# EAGLE design ins_node (EAGLE 8.4.3)
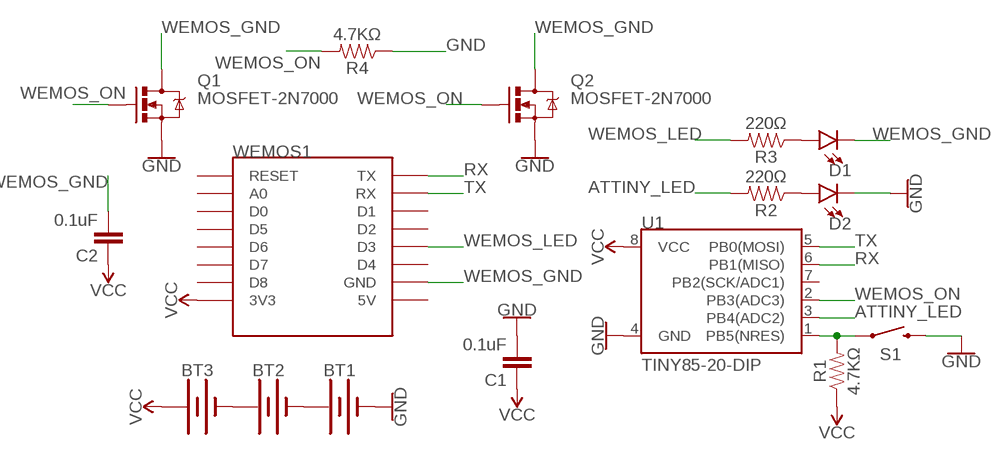
[diagram p0: schematic, sheet 1]

## Parts
BT1  BATTERY-AAA  [BATTERY-AAA]
BT2  BATTERY-AAA  [BATTERY-AAA]
BT3  BATTERY-AAA  [BATTERY-AAA]
C1  0.1uF  0.1UF-KIT-EZ-50V-20%  [CAP-PTH-SMALL-KIT]
C2  0.1uF  0.1UF-KIT-EZ-50V-20%  [CAP-PTH-SMALL-KIT]
D1  LED5MM-KIT  [LED_5MM-KIT]
D2  LED5MM-KIT  [LED_5MM-KIT]
Q1  MOSFET-2N7000  MOSFET-NCHANNEL2N7000  [TO-92]
Q2  MOSFET-2N7000  MOSFET-NCHANNEL2N7000  [TO-92]
R1  4.7KΩ  RESISTORAXIAL-0.3  [AXIAL-0.3]
R2  220Ω  RESISTORAXIAL-0.3  [AXIAL-0.3]
R3  220Ω  RESISTORAXIAL-0.3  [AXIAL-0.3]
R4  4.7KΩ  RESISTORAXIAL-0.3  [AXIAL-0.3]
S1  MOMENTARY-SWITCH-SPST-PTH-6.0MM  [TACTILE_SWITCH_PTH_6.0MM]
U1  TINY85-20-DIP  ATTINY45TINY85-20-DIP  [DIP08_MCU]
WEMOS1  WEMOS-D1-MINI  [WEMOS-D1-MINI]

## Nets
ATTINY_LED: R2.P$2 U1.3(PB4(ADC2))
GND: BT1.GND@1(-) C1.2 D2.K(C) Q1.1(S) Q2.1(S) R4.P$1 S1.3 U1.4(GND)
N$1: BT1.PWR@1(+) BT2.GND@1(-)
N$2: R1.P$2 S1.1 U1.1(PB5(NRES))
N$3: D1.A R3.P$1
N$4: D2.A R2.P$1
N$5: BT2.PWR@1(+) BT3.GND@1(-)
RX: U1.6(PB1(MISO)) WEMOS1.TX
TX: U1.5(PB0(MOSI)) WEMOS1.RX
VCC: BT3.PWR@1(+) C1.1 C2.1 R1.P$1 U1.8(VCC) WEMOS1.3V3
WEMOS_GND: C2.2 D1.K(C) Q1.3(D) Q2.3(D) WEMOS1.GND
WEMOS_LED: R3.P$2 WEMOS1.D3
WEMOS_ON: Q1.2(G) Q2.2(G) R4.P$2 U1.2(PB3(ADC3))
Unconnected: U1.7(PB2(SCK/ADC1)) WEMOS1.5V WEMOS1.A0 WEMOS1.D0 WEMOS1.D1 WEMOS1.D2 WEMOS1.D4 WEMOS1.D5 WEMOS1.D6 WEMOS1.D7 WEMOS1.D8 WEMOS1.RESET

## Library data of the parts
BT1-BT3 = SparkFun-Batteries:BATTERY: Battery - Single Cell A variety of battery chemistries, sizes, and footprints. Device List: 20MM_PTH - Coin Cell Battery Holder - 20mm (PTH) <https://www.sparkfun.com/products/783> 6.8MM_PTH - Coin Cell Battery Holder - 6.8MM(SMD) <https://www.digikey.com/product-detail/en/seiko-instruments/MS621FE-FL11E/728-1057-ND/1889208?WT.srch=1&gclid=CNOQ5a6LzdQCFZS2wAodXCkE0g> 12MM_SMD - Coin Cell Battery Holder - 12mm (SMD) <https://www.sparkfun.com/products/10592> 12MM_PTH - Coin Cell Battery Holder - 12mm (PTH) <https://www.sparkfun.com/products/7948> 20MM_SMD - 20mm Coin Cell Battery Holder (SMD) (2 legs) Used on the Big Time Watch Kit <https://www.sparkfun.com/products/11734> 20MM_SMD_4LEGS - Coin Cell Battery Holder - 20mm (SMD) <https://www.sparkfun.com/products/11892> 20MM_SMD_4LEGS_OVERPASTE - Coin Cell Battery Holder - 20mm (SMD) <https://www.sparkfun.com/products/11892> (Over-paste on the legs) 24.5MM_PTH - Coin Cell Battery Holder - 24.5mm (PTH) <https://www.sparkfun.com/products/8863> 9V - 9V Battery Holder - PC Mount Used on the SparkFun SparkPunk Sound Kit <https://www.sparkfun.com/products/11177> and SparkFun SparkPunk Sequencer Kit <https://www.sparkfun.com/products/12707> 18650 - Battery Holder - 18650 (PTH) <https://www.sparkfun.com/products/13113> AA - Battery Holder - 1xAA (PTH) <https://www.sparkfun.com/products/7949> AAA - Battery Holder - 1xAAA (PTH) <https://www.sparkfun.com/products/12718> AA_KIT - Battery Holder - 1xAA (PTH) <https://www.sparkfun.com/products/7949> Special kit package - pads only have exposed copper on one side of the board. AAA_KIT - Battery Holder - 1xAAA (PTH) <https://www.sparkfun.com/products/12718> Special kit package - pads only have exposed copper on one side of the board.; PROD_ID: BATT-08571; SF_SKU: PRT-12718
C1 C2 = SparkFun-Capacitors:0.1UF: 0.1µF ceramic capacitors A capacitor is a passive two-terminal electrical component used to store electrical energy temporarily in an electric field.; PROD_ID: CAP-08370
D1 D2 = SparkFun-LED:LED: LED (Generic) Standard schematic elements and footprints for 5mm, 3mm, 1206, and 0603 sized LEDs. Generic LEDs with no color specified.
Q1 Q2 = SparkFun-DiscreteSemi:MOSFET-NCHANNEL: Common NMOSFET Parts MFG P/N Store ID Prod ID FDD8780 TRANS-09984 SI7820DN TRANS-11055 FDS6630A IC-08089 2N7002PW TRANS-11151 FQP30N06L COM-10213 TRANS-10060 BSS123LT1G TRANS-08345 BSS138 TRANS-00830 BS170 2N7000
R1-R4 = SparkFun-Resistors:RESISTOR: Generic Resistor Package
S1 = SparkFun-Switches:MOMENTARY-SWITCH-SPST: Momentary Switch (Pushbutton) - SPST Normally-open (NO) SPST momentary switches (buttons, pushbuttons). Variants PTH-12MM - 12mm square, through-hole Momentary Pushbutton Switch - 12mm Square <https://www.sparkfun.com/products/9190> (COM-09190) PTH-6.0MM, PTH-6.0MM-KIT - 6.0mm square, through-hole Mini Pushbutton Switch <https://www.sparkfun.com/products/97> (COM-00097) KIT package intended for soldering kit's - only one side of pads' copper is exposed. PTH-RIGHT-ANGLE-KIT - Right-angle, through-hole Right Angle Tactile Button <https://www.sparkfun.com/products/10791> - Used on SparkFun BigTime Watch Kit <https://www.sparkfun.com/products/11734> SMD-12MM - 12mm square, surface-mount Tactile Button - SMD (12mm) <https://www.sparkfun.com/products/12993> (COM-12993) Used on SparkFun PicoBoard <https://www.sparkfun.com/products/11888> SMD-4.5MM - 4.5mm Square Trackball Switch Used on SparkFun Blackberry Trackballer Breakout <https://www.sparkfun.com/products/13169> SMD-4.6MMX2.8MM - 4.60mm x 2.80mm, surface mount Used on SparkFun SAMD21 Mini Breakout <https://www.sparkfun.com/products/13664> SMD-5.2MM, SMD-5.2-REDUNDANT - 5.2mm square, surface-mount Mini Pushbutton Switch - SMD <https://www.sparkfun.com/products/8720> (COM-08720) Used on Arduino Pro Mini <https://www.sparkfun.com/products/11114> REDUNDANT package connects both switch circuits together SMD-6.0X3.5MM - 6.0 x 3.5mm, surface mount Momentary Reset Switch SMD <https://www.sparkfun.com/products/8229> (COM-08229) SMD-6.2MM-TALL - 6.2mm square, surface mount Tactile Button - SMD (6mm) <https://www.sparkfun.com/products/12992> Used on SparkFun Digital Sandbox <https://www.sparkfun.com/products/12651> SMD-RIGHT-ANGLE - Right-angle, surface mount Used on SparkFun Block for Intel® Edison - Arduino <https://www.sparkfun.com/products/13036>; PROD_ID: SWCH-08441; SF_SKU: COM-00097
U1 = SparkFun-Retired:ATTINY45: Atmel 8-pin 2/4/8kB flash uC Retired; PROD_ID: IC-09445
WEMOS1 = esp8266modules:WEMOS-D1-MINI: WeMos.cc D1 mini ESP8266 module

## Board
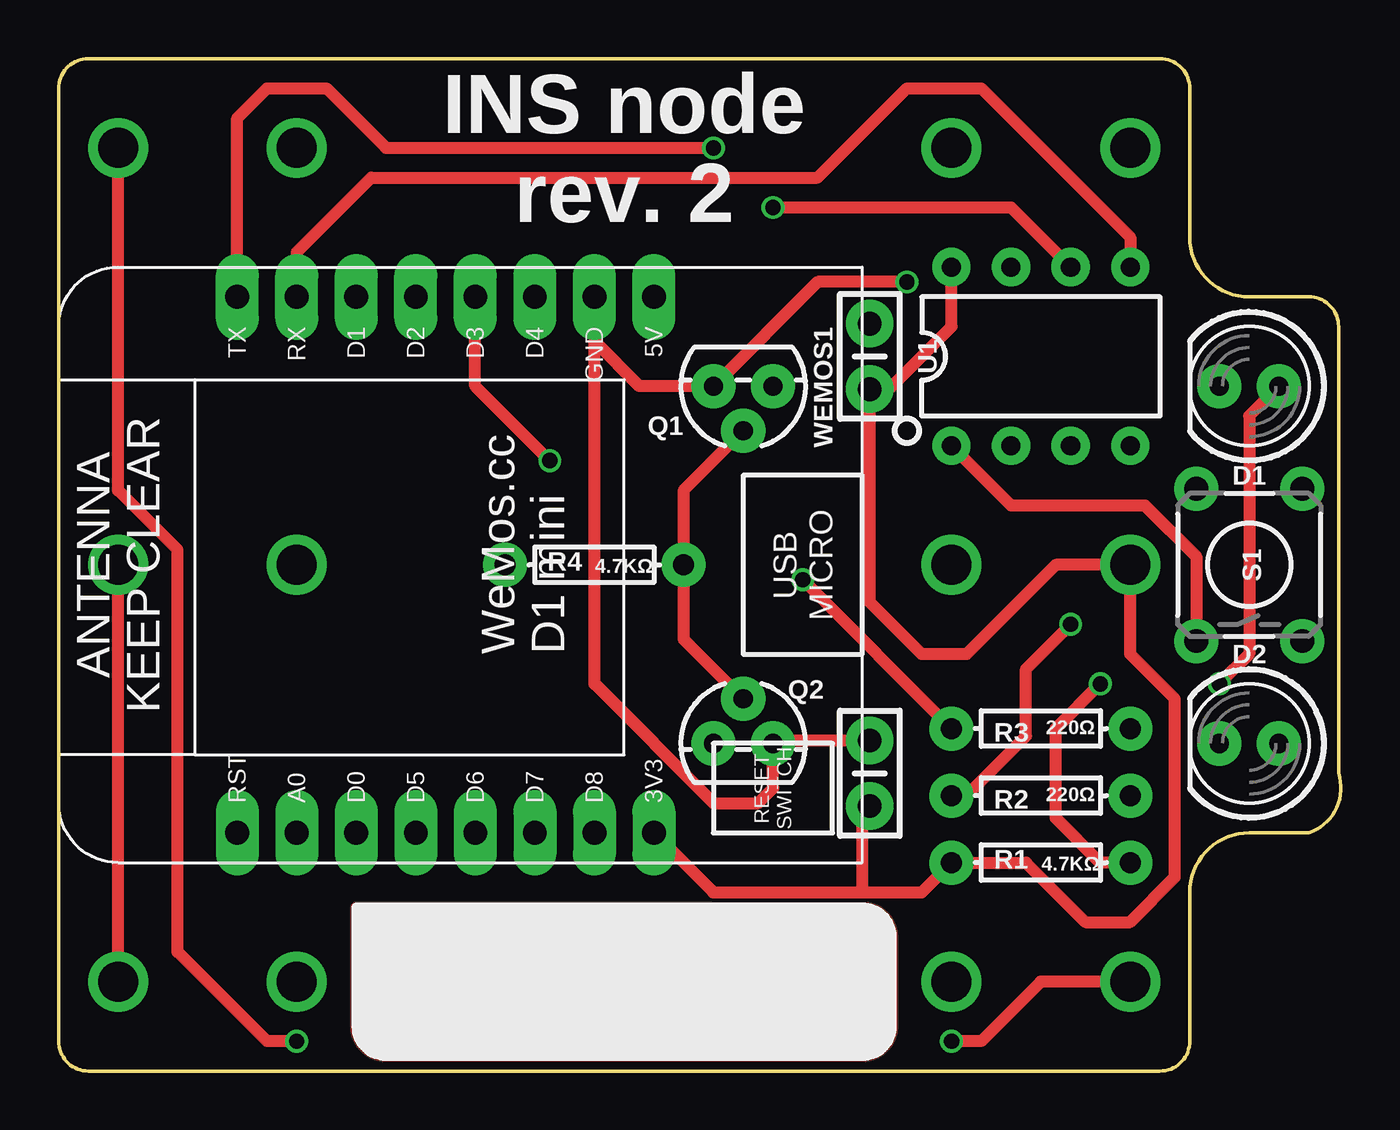
[diagram p1: board, top side]
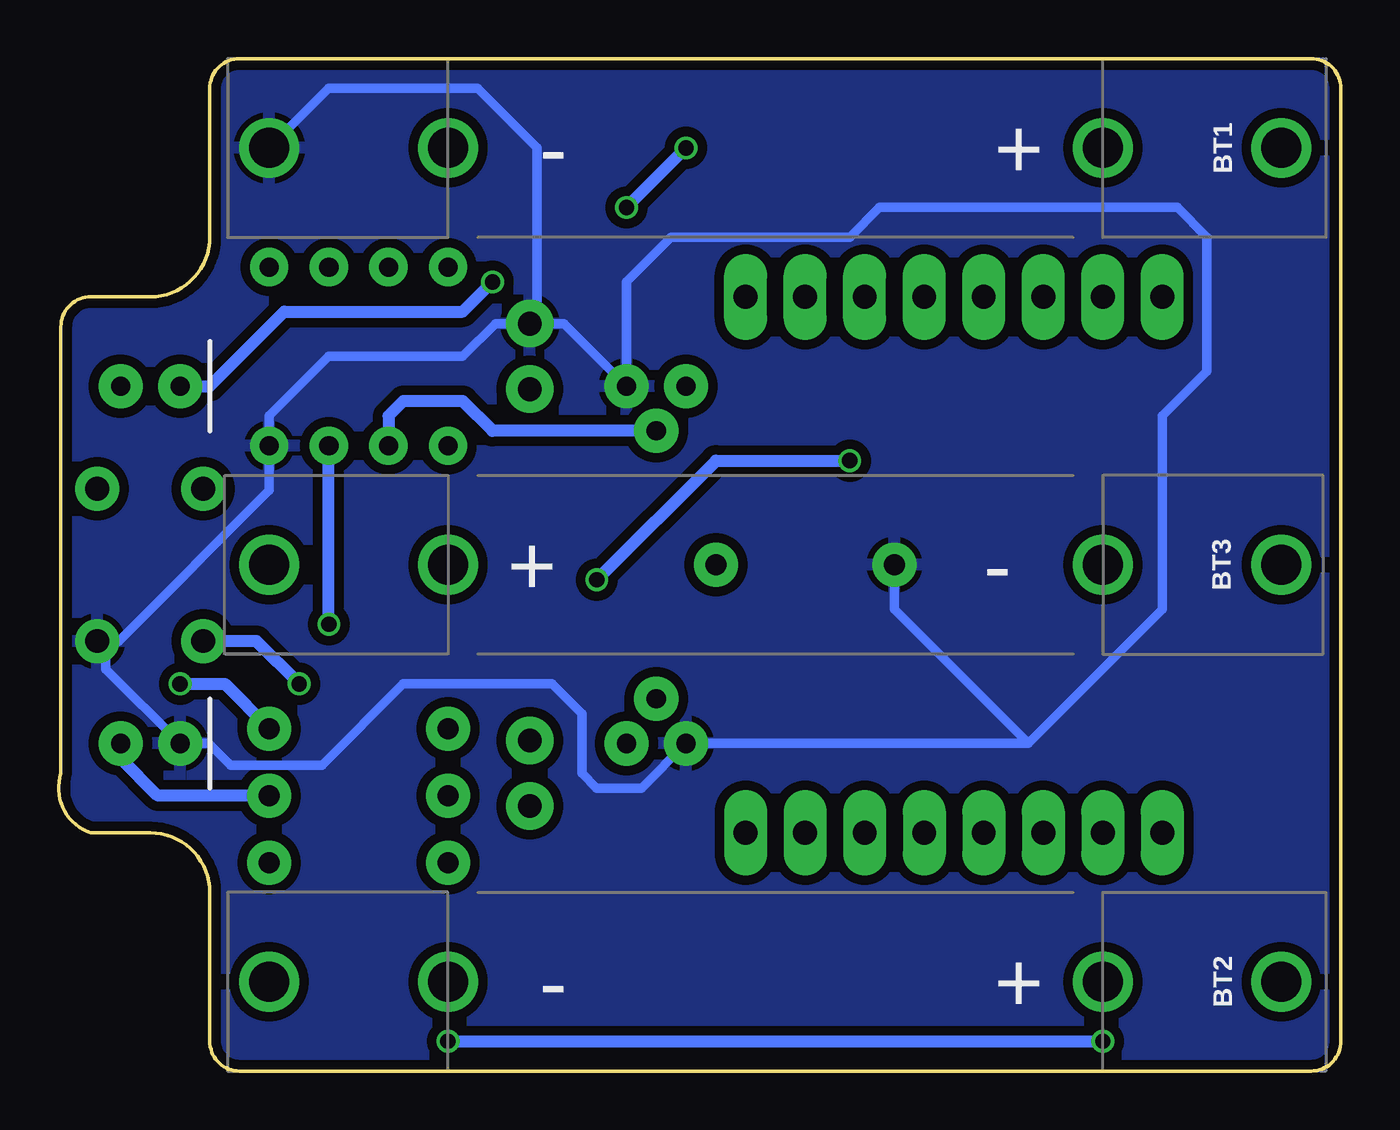
[diagram p2: board, bottom side, seen from below]

Size 54.71 x 43.18 mm. Coordinates in mm from the lower left corner, seen from the top.
Outline: 1.27,43.18 arc90 0,41.91 0,1.27 arc90 1.27,0 46.99,0 arc90 48.26,1.27 48.26,7.62 arc-90 50.8,10.16 53.34,10.16 arc90 54.61,12.7 54.61,31.75 arc90 53.34,33.02 50.8,33.02 arc-90 48.26,35.56 48.26,41.91 arc90 46.99,43.18 1.27,43.18
Copper layers (1*16): Top 0.035mm / dielectric 1.5mm / Bottom 0.035mm
Design rules "SeeedStudio_2layer_DRU_edited": minimum track width 7mil, minimum drill 15mil, track to track 6mil, track to pad 6mil, pad to pad 6mil, via to via 6mil, smd to smd 0mil, copper to edge 10mil, drill to drill 10mil, minimum pad ring 10mil, minimum via ring 6mil, stop-mask expansion 2mil, vias tented up to drill 100mil, thermal gap 10mil

### Footprints (pad centres in the part's own frame; a part is rotated, then mirrored left to right if it is on the bottom)
BATTERY-AAA = drill 1.702: GND@1 21.59,0; GND@2 13.97,0; PWR@1 -21.59,0; PWR@2 -13.97,0
CAP-PTH-SMALL-KIT = drill 1.016 pad 2.032: 1 -1.397,0; 2 1.397,0
LED_5MM-KIT = drill 0.813 pad 1.88: A -1.27,0; K 1.27,0
TO-92 = drill 0.813 pad 1.88: 1 -1.27,0; 2 0,1.905; 3 1.27,0
AXIAL-0.3 = drill 0.9 pad 1.88: P$1 -3.81,0; P$2 3.81,0
TACTILE_SWITCH_PTH_6.0MM = drill 1.016 pad 1.88: 1 -3.251,2.261; 2 3.251,2.261; 3 -3.251,-2.261; 4 3.251,-2.261
DIP08_MCU = drill 0.813 pad 1.626: 1 -3.81,-3.81; 2 -1.27,-3.81; 3 1.27,-3.81; 4 3.81,-3.81; 5 3.81,3.81; 6 1.27,3.81; 7 -1.27,3.81; 8 -3.81,3.81
WEMOS-D1-MINI = drill 1.016 pad 1.829 long: 3V3 -10.16,-10.16; 5V 12.7,-10.16; A0 -10.16,5.08; D0 -10.16,2.54; D1 12.7,2.54; D2 12.7,0; D3 12.7,-2.54; D4 12.7,-5.08; D5 -10.16,0; D6 -10.16,-2.54; D7 -10.16,-5.08; D8 -10.16,-7.62; GND 12.7,-7.62; RESET -10.16,7.62; RX 12.7,5.08; TX 12.7,7.62

### Placement (x,y rotation side)
BT1  24.13,39.37 180 bottom
BT2  24.13,3.81 180 bottom
BT3  24.13,21.59 0 bottom
C1  34.61,30.48 90 top
C2  34.61,12.7 90 top
D1  50.8,29.21 180 top
D2  50.8,13.97 180 top
Q1  29.21,29.21 180 top
Q2  29.21,13.97 0 top
R1  41.91,8.89 0 top
R2  41.91,11.75 180 top
R3  41.91,14.61 180 top
R4  22.86,21.59 0 top
S1  50.8,21.59 90 top
U1  41.91,30.48 0 top
WEMOS1  15.24,20.32 90 top

### Tracks (layer width: path | path; a pad name or v marks a point on that pad's centre or on a via)
ATTINY_LED  (via drill 0.65)
  Top 0.508: v43.18,19.05 41.27,17.14 41.27,14.29 38.74,11.75 R2.P$2
  Bottom 0.508: v43.18,19.05 U1.3
GND
  Bottom 0.406: C1.2 34.29,32.19 34.29,39.37 36.83,41.91 43.18,41.91 BT1.GND@1 | C1.2 33.15,31.88 Q1.1 30.48,33.66 28.58,35.56 20.95,35.56 19.69,36.83 6.98,36.83 5.71,35.56 5.71,29.85 7.62,27.94 7.62,19.68 13.34,13.97 | 28.65,13.97 Q2.1 | Q2.1 29.84,12.07 31.75,12.07 32.38,12.7 32.38,15.24 33.66,16.51 40.01,16.51 43.47,13.04 47.37,13.04 48.3,13.97 D2.K 52.71,17.14 52.71,17.98 S1.3 52.15,18.34 45.72,24.76 U1.4 45.72,27.94 43.18,30.48 37.47,30.48 36.07,31.88 C1.2 | 34.73,31.75 C1.2 | Q2.1 13.34,13.97 | 13.34,13.97 19.05,19.68 R4.P$1
  pour Bottom (isolate 0.406): 0,43.18 48.26,43.18 48.26,34.29 54.61,34.29 54.61,8.89 48.26,8.89 48.26,0 0,0
N$1  (via drill 0.65)
  Top 0.508: BT1.PWR@1 2.54,24.76 5.08,22.22 5.08,5.08 8.89,1.27 v10.16,1.27 | BT2.GND@1 41.91,3.81 39.37,1.27 v38.1,1.27
  Bottom 0.508: v38.1,1.27 v10.16,1.27
N$2  (via drill 0.65)
  Top 0.508: U1.1 40.64,24.13 46.35,24.13 48.54,21.95 S1.1 | v44.45,16.51 42.54,14.61 42.54,10.79 44.45,8.89 R1.P$2
  Bottom 0.508: v44.45,16.51 46.28,18.34 S1.1
N$3  (via drill 0.65)
  Top 0.508: D1.A 50.8,27.94 50.8,17.78 v49.53,16.51
  Bottom 0.508: v49.53,16.51 47.63,16.51 R3.P$1
N$4
  Bottom 0.508: D2.A 52.07,13.33 50.48,11.75 R2.P$1
N$5
  Top 0.508: BT2.PWR@1 BT3.GND@1
N$6
  pour Top: 12.7,6.99 34.29,6.99 arc-90 35.56,5.71 35.56,1.9 arc-90 34.29,0.63 13.97,0.63 arc-90 12.7,1.9
RX  (via drill 0.65)
  Top 0.508: U1.6 40.64,36.83 v30.48,36.83 | WEMOS1.TX 7.62,40.64 8.89,41.91 11.43,41.91 13.97,39.37 v27.94,39.37
  Bottom 0.508: v27.94,39.37 v30.48,36.83
TX
  Top 0.508: WEMOS1.RX 10.16,34.92 13.34,38.1 32.38,38.1 36.2,41.91 39.37,41.91 45.72,35.56 U1.5
VCC
  Top 0.508: 34.29,7.62 27.94,7.62 WEMOS1.3V3 | U1.8 38.1,31.75 35.43,29.08 C1.1 34.61,20 36.83,17.78 38.74,17.78 42.54,21.59 45.7,21.59 | 34.29,7.62 34.29,10.99 C2.1 | 34.29,7.62 36.83,7.62 R1.P$1 41.27,8.89 43.82,6.35 45.72,6.35 47.63,8.25 47.63,15.87 45.72,17.78 45.72,21.57 45.7,21.59 | 45.7,21.59 BT3.PWR@1
WEMOS_GND  (via drill 0.65)
  Top 0.508: WEMOS1.GND 22.86,31.11 | 22.86,31.11 24.77,29.21 Q1.3 32.38,33.66 v36.2,33.66 | 22.86,31.11 22.86,16.51 27.94,11.43 29.84,11.43 30.48,12.07 Q2.3 30.61,14.1 C2.2
  Bottom 0.508: D1.K 48.26,29.21 45.09,32.39 37.47,32.39 v36.2,33.66
WEMOS_LED  (via drill 0.65)
  Top 0.508: R3.P$2 v31.75,20.96 | v20.95,26.04 17.78,29.21 WEMOS1.D3
  Bottom 0.508: v31.75,20.96 26.67,26.04 v20.95,26.04
WEMOS_ON
  Top 0.508: Q1.2 26.67,24.76 R4.P$2 26.67,18.42 Q2.2
  Bottom 0.508: Q1.2 36.2,27.3 37.47,28.57 40.01,28.57 40.64,27.94 U1.2

### Text on the board
tPlace: INS node / rev. 2
tRestrict: NODE ID